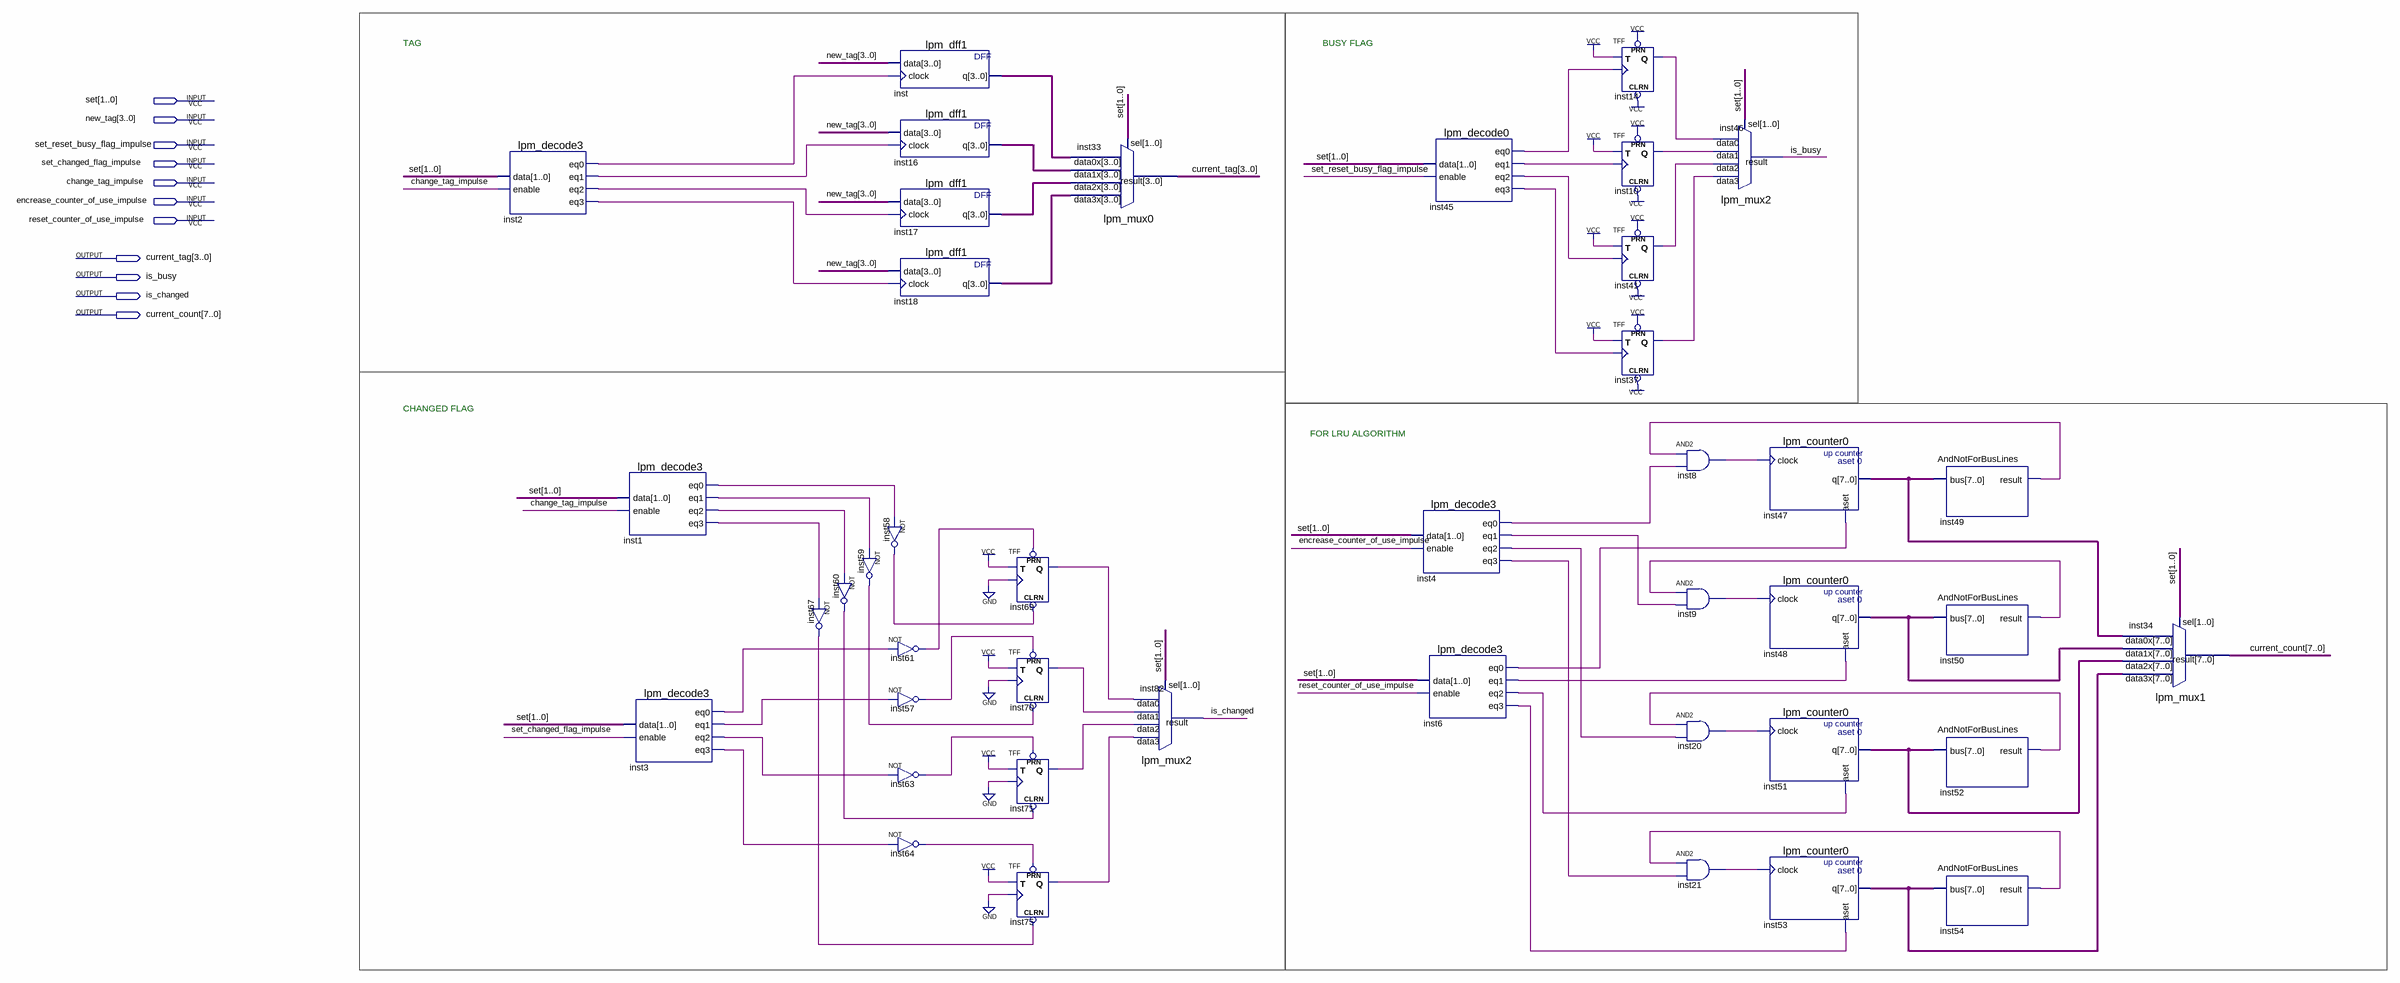
[diagram p0: schematic sheet]
// Quartus schematic CacheControlBlock.bdf as structural Verilog: 42 symbols, 11 pins
module CacheControlBlock (
  input  [1:0] set,
  input  [3:0] new_tag,
  input  set_reset_busy_flag_impulse,
  input  set_changed_flag_impulse,
  input  change_tag_impulse,
  input  encrease_counter_of_use_impulse,
  input  reset_counter_of_use_impulse,
  output [3:0] current_tag,
  output is_busy,
  output is_changed,
  output [7:0] current_count
);

  wire inst1_eq0, inst1_eq1, inst1_eq2, inst1_eq3, inst2_eq0, inst2_eq1, inst2_eq2, inst2_eq3, inst3_eq0,
       inst3_eq1, inst3_eq2, inst3_eq3, inst4_eq0, inst4_eq1, inst4_eq2, inst4_eq3, inst6_eq0, inst6_eq1,
       inst6_eq2, inst6_eq3, inst8_out, inst9_out, inst10_q, inst14_q, inst20_out, inst21_out, inst37_q,
       inst41_q, inst45_eq0, inst45_eq1, inst45_eq2, inst45_eq3, inst49_result, inst50_result, inst52_result,
       inst54_result, inst57_out, inst58_out, inst59_out, inst60_out, inst61_out, inst63_out, inst64_out,
       inst67_out, inst69_q, inst70_q, inst71_q, inst75_q;
  wire [3:0] inst16_q, inst17_q, inst18_q, inst_q;
  wire [7:0] inst47_q, inst48_q, inst51_q, inst53_q;

  lpm_decode3 inst2 (
    .data(set), .enable(change_tag_impulse), .eq0(inst2_eq0), .eq1(inst2_eq1), .eq2(inst2_eq2),
    .eq3(inst2_eq3));
  lpm_decode3 inst1 (
    .data(set), .enable(change_tag_impulse), .eq0(inst1_eq0), .eq1(inst1_eq1), .eq2(inst1_eq2),
    .eq3(inst1_eq3));
  lpm_decode3 inst3 (
    .data(set), .enable(set_changed_flag_impulse), .eq0(inst3_eq0), .eq1(inst3_eq1), .eq2(inst3_eq2),
    .eq3(inst3_eq3));
  not inst67 (inst67_out, inst1_eq3);
  not inst59 (inst59_out, inst1_eq1);
  not inst60 (inst60_out, inst1_eq2);
  lpm_dff1 inst (.data(new_tag), .clock(inst2_eq0), .q(inst_q));
  lpm_dff1 inst16 (.data(new_tag), .clock(inst2_eq1), .q(inst16_q));
  lpm_dff1 inst17 (.data(new_tag), .clock(inst2_eq2), .q(inst17_q));
  lpm_dff1 inst18 (.data(new_tag), .clock(inst2_eq3), .q(inst18_q));
  not inst58 (inst58_out, inst1_eq0);
  not inst61 (inst61_out, inst3_eq0);
  not inst57 (inst57_out, inst3_eq1);
  not inst63 (inst63_out, inst3_eq2);
  not inst64 (inst64_out, inst3_eq3);
  TFF inst69 (.PRN(inst61_out), .CLRN(inst58_out), .T(1'b1), .CLK(1'b0), .Q(inst69_q));
  TFF inst70 (.PRN(inst57_out), .CLRN(inst59_out), .T(1'b1), .CLK(1'b0), .Q(inst70_q));
  TFF inst71 (.PRN(inst63_out), .CLRN(inst60_out), .T(1'b1), .CLK(1'b0), .Q(inst71_q));
  TFF inst75 (.PRN(inst64_out), .CLRN(inst67_out), .T(1'b1), .CLK(1'b0), .Q(inst75_q));
  lpm_mux0 inst33 (
    .data3x(inst18_q), .data2x(inst17_q), .data1x(inst16_q), .data0x(inst_q), .sel(set), .result(current_tag));
  lpm_mux2 inst82 (
    .data3(inst75_q), .data2(inst71_q), .data1(inst70_q), .data0(inst69_q), .sel(set), .result(is_changed));
  lpm_decode3 inst4 (
    .data(set), .enable(encrease_counter_of_use_impulse), .eq0(inst4_eq0), .eq1(inst4_eq1), .eq2(inst4_eq2),
    .eq3(inst4_eq3));
  lpm_decode0 inst45 (
    .data(set), .enable(set_reset_busy_flag_impulse), .eq0(inst45_eq0), .eq1(inst45_eq1), .eq2(inst45_eq2),
    .eq3(inst45_eq3));
  lpm_decode3 inst6 (
    .data(set), .enable(reset_counter_of_use_impulse), .eq0(inst6_eq0), .eq1(inst6_eq1), .eq2(inst6_eq2),
    .eq3(inst6_eq3));
  TFF inst14 (.PRN(1'b1), .CLRN(1'b1), .T(1'b1), .CLK(inst45_eq0), .Q(inst14_q));
  TFF inst10 (.PRN(1'b1), .CLRN(1'b1), .T(1'b1), .CLK(inst45_eq1), .Q(inst10_q));
  TFF inst41 (.PRN(1'b1), .CLRN(1'b1), .T(1'b1), .CLK(inst45_eq2), .Q(inst41_q));
  TFF inst37 (.PRN(1'b1), .CLRN(1'b1), .T(1'b1), .CLK(inst45_eq3), .Q(inst37_q));
  lpm_mux2 inst46 (.data3(inst37_q), .data2(inst41_q), .data1(inst10_q), .data0(inst14_q), .sel(set), .result(is_busy));
  and inst8 (inst8_out, inst49_result, inst4_eq0);
  and inst9 (inst9_out, inst50_result, inst4_eq1);
  and inst20 (inst20_out, inst52_result, inst4_eq2);
  and inst21 (inst21_out, inst54_result, inst4_eq3);
  lpm_counter0 inst47 (.clock(inst8_out), .aset(inst6_eq0), .q(inst47_q));
  lpm_counter0 inst48 (.clock(inst9_out), .aset(inst6_eq1), .q(inst48_q));
  lpm_counter0 inst51 (.clock(inst20_out), .aset(inst6_eq2), .q(inst51_q));
  lpm_counter0 inst53 (.clock(inst21_out), .aset(inst6_eq3), .q(inst53_q));
  AndNotForBusLines inst49 (.bus(inst47_q), .result(inst49_result));
  AndNotForBusLines inst50 (.bus(inst48_q), .result(inst50_result));
  AndNotForBusLines inst52 (.bus(inst51_q), .result(inst52_result));
  AndNotForBusLines inst54 (.bus(inst53_q), .result(inst54_result));
  lpm_mux1 inst34 (
    .data3x(inst53_q), .data2x(inst51_q), .data1x(inst48_q), .data0x(inst47_q), .sel(set),
    .result(current_count));

  // Notes on the sheet:
  //   TAG
  //   BUSY FLAG
  //   CHANGED FLAG
  //   FOR LRU ALGORITHM
endmodule
